# Altium schematic sheet Schematic.SchDoc
size 558 x 431 mm; SheetNumber: 1; SheetTotal: 1
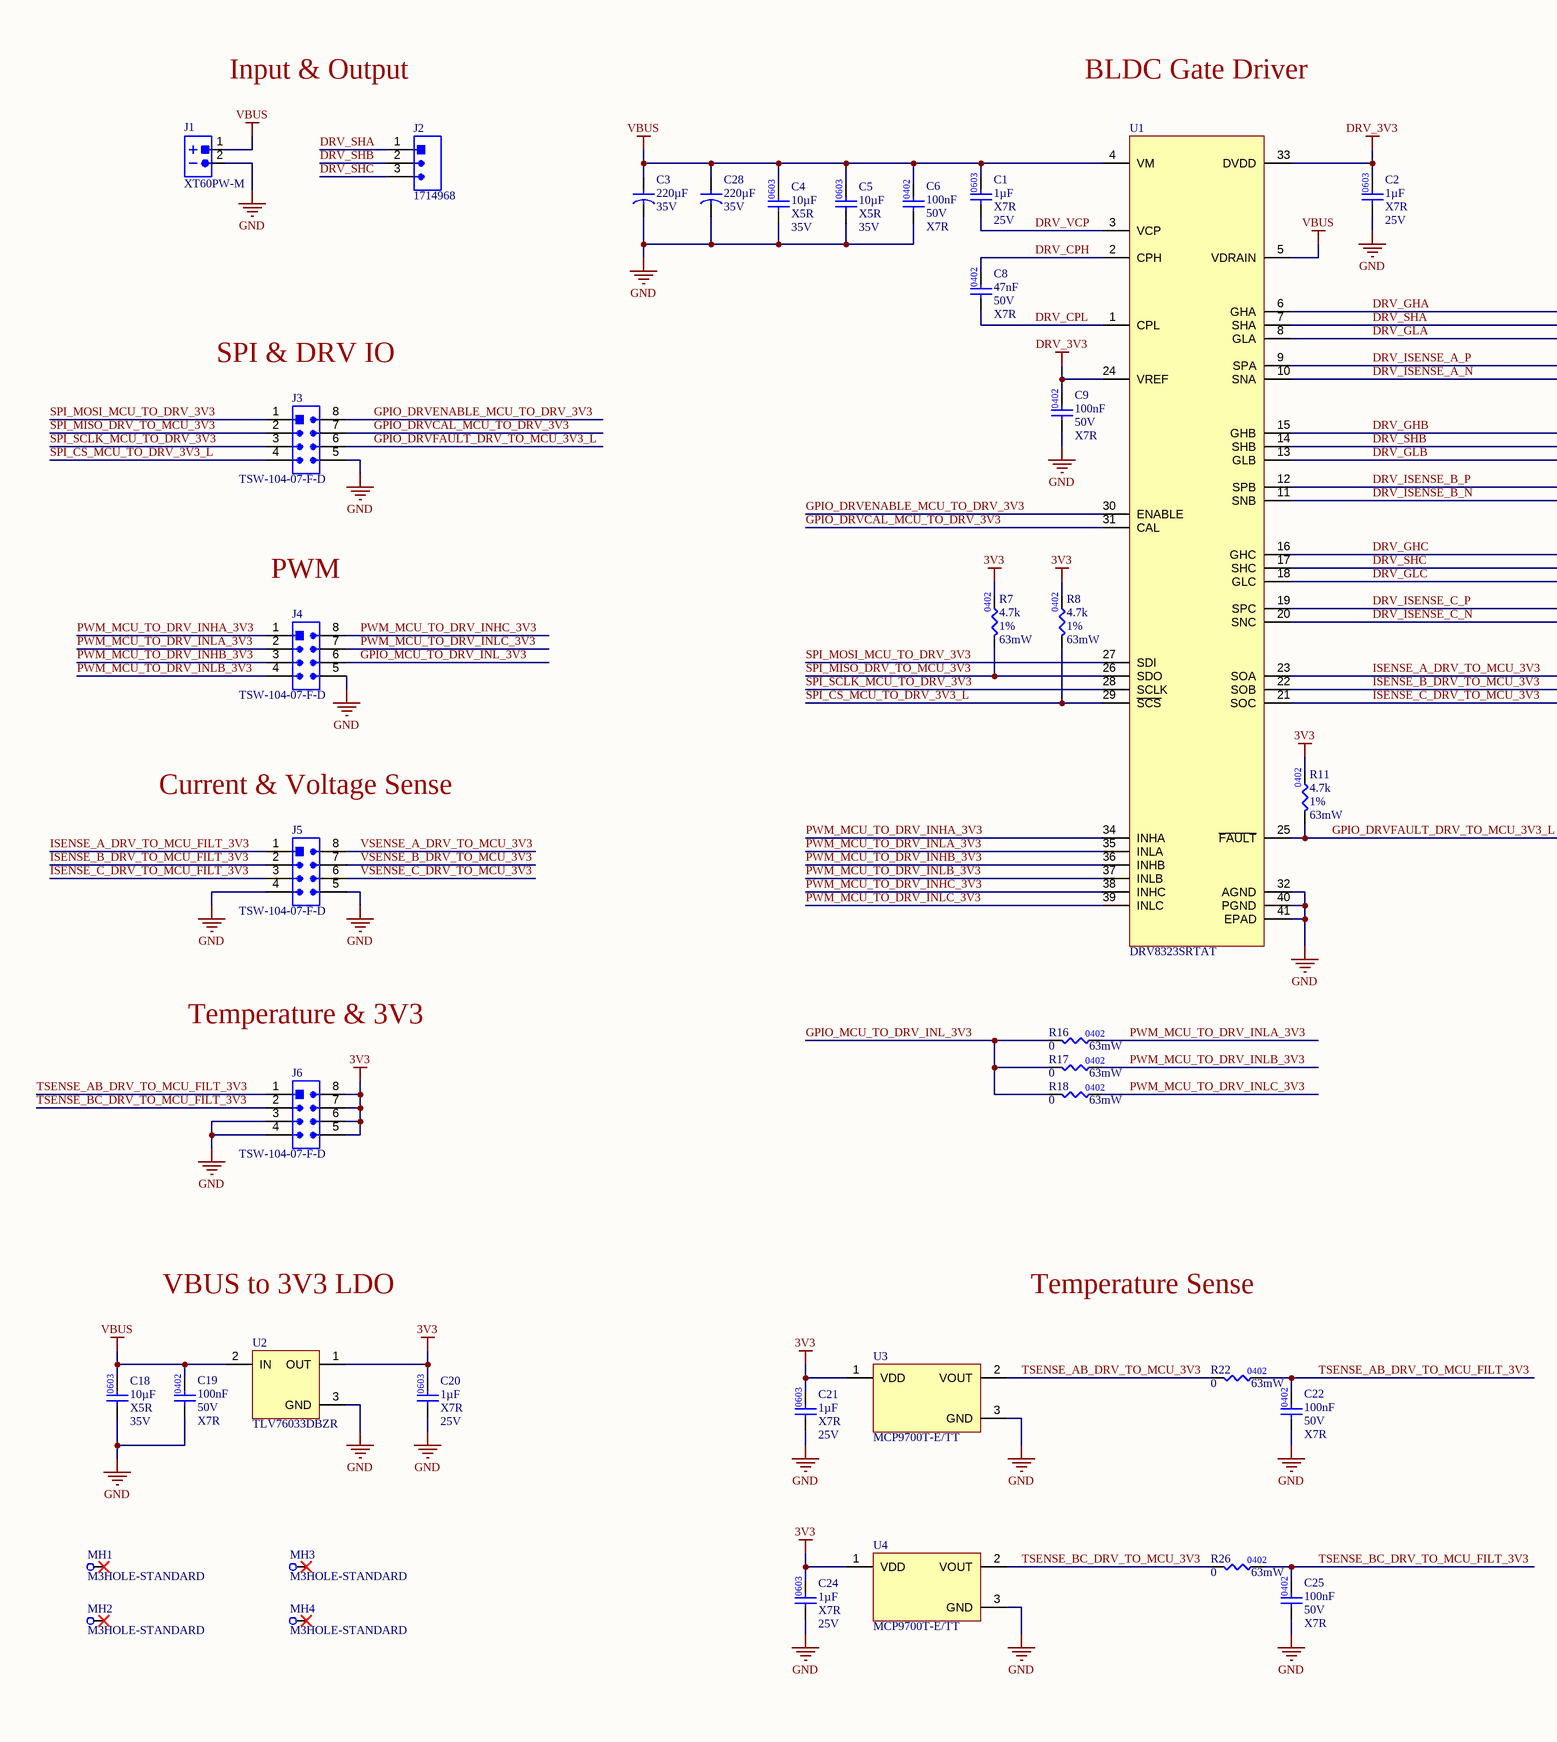
[diagram p0: Schematic.SchDoc, left]
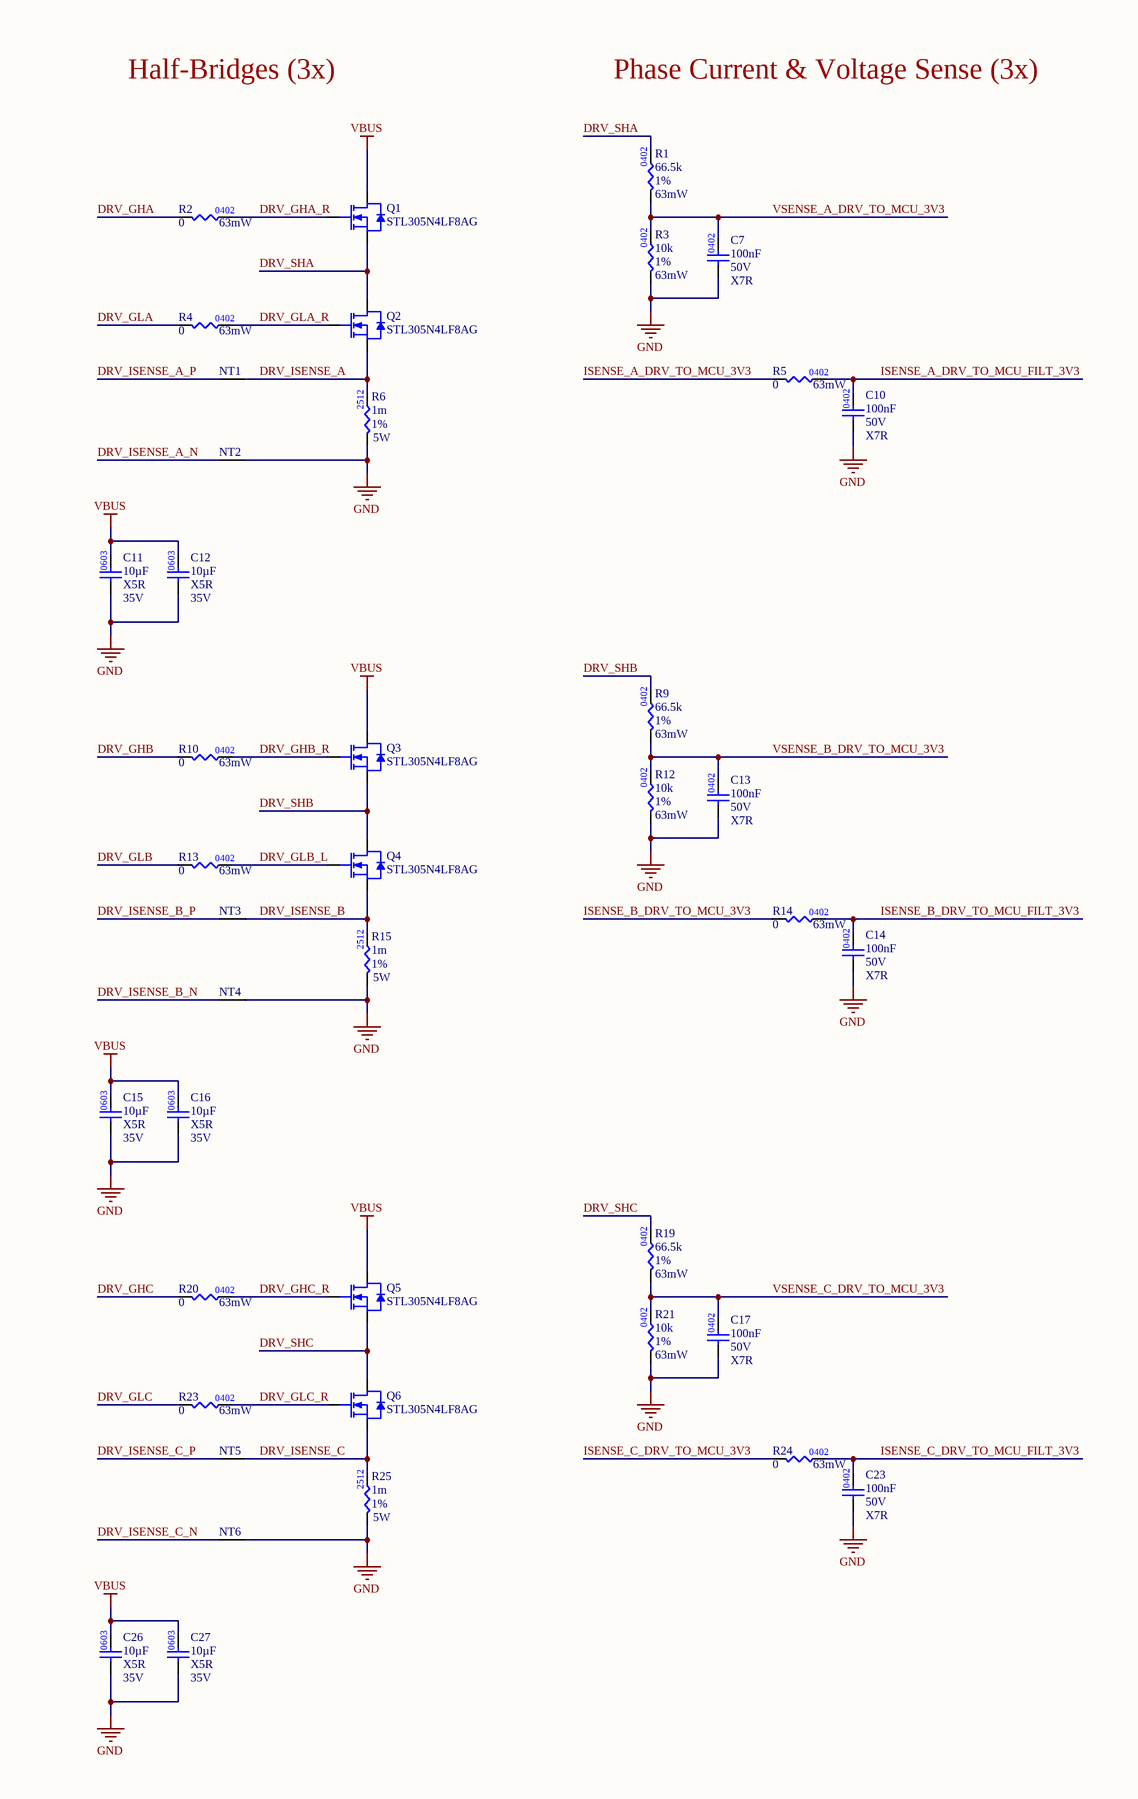
[diagram p1: Schematic.SchDoc, right]

## Parts
C1  value 1µF  Temperature Coefficient: X7R  Voltage Rating: 25V  [.CAP_0603-Footprint-1]  (hidden comment: CL10B105KA8NNNC)
C2  value 1µF  Temperature Coefficient: X7R  Voltage Rating: 25V  [.CAP_0603-Footprint-1]  (hidden comment: CL10B105KA8NNNC)
C3  value 220µF  Voltage Rating: 35V  [865080553014-Footprint-1]  (hidden comment: 865080553014)
C4  value 10µF  Temperature Coefficient: X5R  Voltage Rating: 35V  [.CAP_0603-Footprint-1]  (hidden comment: GRM188R6YA106MA73D)
C5  value 10µF  Temperature Coefficient: X5R  Voltage Rating: 35V  [.CAP_0603-Footprint-1]  (hidden comment: GRM188R6YA106MA73D)
C6  value 100nF  Voltage Rating: 50V  Temperature Coefficient: X7R  [.CAP_0402-Footprint-1]  (hidden comment: GCM155R71H104KE02D)
C7  value 100nF  Voltage Rating: 50V  Temperature Coefficient: X7R  [.CAP_0402-Footprint-1]  (hidden comment: GCM155R71H104KE02D)
C8  value 47nF  Voltage Rating: 50V  Temperature Coefficient: X7R  [.CAP_0402-Footprint-1]  (hidden comment: GRM155R71H473KE14D)
C9  value 100nF  Voltage Rating: 50V  Temperature Coefficient: X7R  [.CAP_0402-Footprint-1]  (hidden comment: GCM155R71H104KE02D)
C10  value 100nF  Voltage Rating: 50V  Temperature Coefficient: X7R  [.CAP_0402-Footprint-1]  (hidden comment: GCM155R71H104KE02D)
C11  value 10µF  Temperature Coefficient: X5R  Voltage Rating: 35V  [.CAP_0603-Footprint-1]  (hidden comment: GRM188R6YA106MA73D)
C12  value 10µF  Temperature Coefficient: X5R  Voltage Rating: 35V  [.CAP_0603-Footprint-1]  (hidden comment: GRM188R6YA106MA73D)
C13  value 100nF  Voltage Rating: 50V  Temperature Coefficient: X7R  [.CAP_0402-Footprint-1]  (hidden comment: GCM155R71H104KE02D)
C14  value 100nF  Voltage Rating: 50V  Temperature Coefficient: X7R  [.CAP_0402-Footprint-1]  (hidden comment: GCM155R71H104KE02D)
C15  value 10µF  Temperature Coefficient: X5R  Voltage Rating: 35V  [.CAP_0603-Footprint-1]  (hidden comment: GRM188R6YA106MA73D)
C16  value 10µF  Temperature Coefficient: X5R  Voltage Rating: 35V  [.CAP_0603-Footprint-1]  (hidden comment: GRM188R6YA106MA73D)
C17  value 100nF  Voltage Rating: 50V  Temperature Coefficient: X7R  [.CAP_0402-Footprint-1]  (hidden comment: GCM155R71H104KE02D)
C18  value 10µF  Temperature Coefficient: X5R  Voltage Rating: 35V  [.CAP_0603-Footprint-1]  (hidden comment: GRM188R6YA106MA73D)
C19  value 100nF  Voltage Rating: 50V  Temperature Coefficient: X7R  [.CAP_0402-Footprint-1]  (hidden comment: GCM155R71H104KE02D)
C20  value 1µF  Temperature Coefficient: X7R  Voltage Rating: 25V  [.CAP_0603-Footprint-1]  (hidden comment: CL10B105KA8NNNC)
C21  value 1µF  Temperature Coefficient: X7R  Voltage Rating: 25V  [.CAP_0603-Footprint-1]  (hidden comment: CL10B105KA8NNNC)
C22  value 100nF  Voltage Rating: 50V  Temperature Coefficient: X7R  [.CAP_0402-Footprint-1]  (hidden comment: GCM155R71H104KE02D)
C23  value 100nF  Voltage Rating: 50V  Temperature Coefficient: X7R  [.CAP_0402-Footprint-1]  (hidden comment: GCM155R71H104KE02D)
C24  value 1µF  Temperature Coefficient: X7R  Voltage Rating: 25V  [.CAP_0603-Footprint-1]  (hidden comment: CL10B105KA8NNNC)
C25  value 100nF  Voltage Rating: 50V  Temperature Coefficient: X7R  [.CAP_0402-Footprint-1]  (hidden comment: GCM155R71H104KE02D)
C26  value 10µF  Temperature Coefficient: X5R  Voltage Rating: 35V  [.CAP_0603-Footprint-1]  (hidden comment: GRM188R6YA106MA73D)
C27  value 10µF  Temperature Coefficient: X5R  Voltage Rating: 35V  [.CAP_0603-Footprint-1]  (hidden comment: GRM188R6YA106MA73D)
C28  value 220µF  Voltage Rating: 35V  [865080553014-Footprint-1]  (hidden comment: 865080553014)
J1  XT60PW-M  [XT60PW-M-Footprint-1]
J2  1714968  [1714968-Footprint-1]
J3  TSW-104-07-F-D  [TSW-104-07-F-D-Footprint-1]
J4  TSW-104-07-F-D  [TSW-104-07-F-D-Footprint-1]
J5  TSW-104-07-F-D  [TSW-104-07-F-D-Footprint-1]
J6  TSW-104-07-F-D  [TSW-104-07-F-D-Footprint-1]
MH1  M3HOLE-STANDARD  [M3HOLE-STANDARD-Footprint-1]
MH2  M3HOLE-STANDARD  [M3HOLE-STANDARD-Footprint-1]
MH3  M3HOLE-STANDARD  [M3HOLE-STANDARD-Footprint-1]
MH4  M3HOLE-STANDARD  [M3HOLE-STANDARD-Footprint-1]
NT1  NET_TIE_127um  [NET_TIE_127um-Footprint-1]  (value not drawn)
NT2  NET_TIE_127um  [NET_TIE_127um-Footprint-1]  (value not drawn)
NT3  NET_TIE_127um  [NET_TIE_127um-Footprint-1]  (value not drawn)
NT4  NET_TIE_127um  [NET_TIE_127um-Footprint-1]  (value not drawn)
NT5  NET_TIE_127um  [NET_TIE_127um-Footprint-1]  (value not drawn)
NT6  NET_TIE_127um  [NET_TIE_127um-Footprint-1]  (value not drawn)
Q1  STL305N4LF8AG  [STL305N4LF8AG-Footprint-1]
Q2  STL305N4LF8AG  [STL305N4LF8AG-Footprint-1]
Q3  STL305N4LF8AG  [STL305N4LF8AG-Footprint-1]
Q4  STL305N4LF8AG  [STL305N4LF8AG-Footprint-1]
Q5  STL305N4LF8AG  [STL305N4LF8AG-Footprint-1]
Q6  STL305N4LF8AG  [STL305N4LF8AG-Footprint-1]
R1  value 66.5k  Tolerance: 1%  Power: 63mW  [.RES_0402-Footprint-1]  (hidden comment: RC0402FR-0766K5L)
R2  value 0  Power: 63mW  [.RES_0402-Footprint-1]  (hidden comment: RC0402JR-070RL)
R3  value 10k  Tolerance: 1%  Power: 63mW  [.RES_0402-Footprint-1]  (hidden comment: RC0402FR-0710KL)
R4  value 0  Power: 63mW  [.RES_0402-Footprint-1]  (hidden comment: RC0402JR-070RL)
R5  value 0  Power: 63mW  [.RES_0402-Footprint-1]  (hidden comment: RC0402JR-070RL)
R6  value 1m  Power: 5W  Tolerance: 1%  [WSLF25121L000FEA-Footprint-1]  (hidden comment: WSLF25121L000FEA)
R7  value 4.7k  Tolerance: 1%  Power: 63mW  [.RES_0402-Footprint-1]  (hidden comment: RC0402FR-074K7L)
R8  value 4.7k  Tolerance: 1%  Power: 63mW  [.RES_0402-Footprint-1]  (hidden comment: RC0402FR-074K7L)
R9  value 66.5k  Tolerance: 1%  Power: 63mW  [.RES_0402-Footprint-1]  (hidden comment: RC0402FR-0766K5L)
R10  value 0  Power: 63mW  [.RES_0402-Footprint-1]  (hidden comment: RC0402JR-070RL)
R11  value 4.7k  Tolerance: 1%  Power: 63mW  [.RES_0402-Footprint-1]  (hidden comment: RC0402FR-074K7L)
R12  value 10k  Tolerance: 1%  Power: 63mW  [.RES_0402-Footprint-1]  (hidden comment: RC0402FR-0710KL)
R13  value 0  Power: 63mW  [.RES_0402-Footprint-1]  (hidden comment: RC0402JR-070RL)
R14  value 0  Power: 63mW  [.RES_0402-Footprint-1]  (hidden comment: RC0402JR-070RL)
R15  value 1m  Power: 5W  Tolerance: 1%  [WSLF25121L000FEA-Footprint-1]  (hidden comment: WSLF25121L000FEA)
R16  value 0  Power: 63mW  [.RES_0402-Footprint-1]  (hidden comment: RC0402JR-070RL)
R17  value 0  Power: 63mW  [.RES_0402-Footprint-1]  (hidden comment: RC0402JR-070RL)
R18  value 0  Power: 63mW  [.RES_0402-Footprint-1]  (hidden comment: RC0402JR-070RL)
R19  value 66.5k  Tolerance: 1%  Power: 63mW  [.RES_0402-Footprint-1]  (hidden comment: RC0402FR-0766K5L)
R20  value 0  Power: 63mW  [.RES_0402-Footprint-1]  (hidden comment: RC0402JR-070RL)
R21  value 10k  Tolerance: 1%  Power: 63mW  [.RES_0402-Footprint-1]  (hidden comment: RC0402FR-0710KL)
R22  value 0  Power: 63mW  [.RES_0402-Footprint-1]  (hidden comment: RC0402JR-070RL)
R23  value 0  Power: 63mW  [.RES_0402-Footprint-1]  (hidden comment: RC0402JR-070RL)
R24  value 0  Power: 63mW  [.RES_0402-Footprint-1]  (hidden comment: RC0402JR-070RL)
R25  value 1m  Power: 5W  Tolerance: 1%  [WSLF25121L000FEA-Footprint-1]  (hidden comment: WSLF25121L000FEA)
R26  value 0  Power: 63mW  [.RES_0402-Footprint-1]  (hidden comment: RC0402JR-070RL)
U1  DRV8323SRTAT  [QFN50P600X600X80_HS-41N]
U2  TLV76033DBZR  [TLV76033DBZR-Footprint-1]
U3  MCP9700T-E/TT  [MCP9700T-E_TT-Footprint-1]
U4  MCP9700T-E/TT  [MCP9700T-E_TT-Footprint-1]

## Nets
3V3: C20.2 C21.2 C24.2 J6.5 J6.6 J6.7 J6.8 R7.2 R8.2 R11.2 U2.1(OUT) U3.1(VDD) U4.1(VDD)
DRV_3V3: C2.2 C9.2 U1.24(VREF) U1.33(DVDD)
GND: C2.1 C3.2 C4.1 C5.1 C6.1 C7.1 C9.1 C10.1 C11.1 C12.1 C13.1 C14.1 C15.1 C16.1 C17.1 C18.1 C19.1 C20.1 C21.1 C22.1 C23.1 C24.1 C25.1 C26.1 C27.1 C28.2 J1.2 J3.5 J4.5 J5.4 J5.5 J6.3 J6.4 NT2.2 NT4.2 NT6.2 R3.1 R6.1 R12.1 R15.1 R21.1 R25.1 U1.32(AGND) U1.40(PGND) U1.41(EPAD) U2.3(GND) U3.3(GND) U4.3(GND)
VBUS: C1.2 C3.1 C4.2 C5.2 C6.2 C11.2 C12.2 C15.2 C16.2 C18.2 C19.2 C26.2 C27.2 C28.1 J1.1 Q1.3(D) Q3.3(D) Q5.3(D) U1.4(VM) U1.5(VDRAIN) U2.2(IN)
DRV_CPH: C8.2 U1.2(CPH)
DRV_CPL: C8.1 U1.1(CPL)
DRV_GHA: R2.1 U1.6(GHA)
DRV_GHA_R: Q1.1(G) R2.2
DRV_GHB: R10.1 U1.15(GHB)
DRV_GHB_R: Q3.1(G) R10.2
DRV_GHC: R20.1 U1.16(GHC)
DRV_GHC_R: Q5.1(G) R20.2
DRV_GLA: R4.1 U1.8(GLA)
DRV_GLA_R: Q2.1(G) R4.2
DRV_GLB: R13.1 U1.13(GLB)
DRV_GLB_L: Q4.1(G) R13.2
DRV_GLC: R23.1 U1.18(GLC)
DRV_GLC_R: Q6.1(G) R23.2
DRV_ISENSE_A: NT1.2 Q2.2(S) R6.2
DRV_ISENSE_A_N: NT2.1 U1.10(SNA)
DRV_ISENSE_A_P: NT1.1 U1.9(SPA)
DRV_ISENSE_B: NT3.2 Q4.2(S) R15.2
DRV_ISENSE_B_N: NT4.1 U1.11(SNB)
DRV_ISENSE_B_P: NT3.1 U1.12(SPB)
DRV_ISENSE_C: NT5.2 Q6.2(S) R25.2
DRV_ISENSE_C_N: NT6.1 U1.20(SNC)
DRV_ISENSE_C_P: NT5.1 U1.19(SPC)
DRV_SHA: J2.1 Q1.2(S) Q2.3(D) R1.2 U1.7(SHA)
DRV_SHB: J2.2 Q3.2(S) Q4.3(D) R9.2 U1.14(SHB)
DRV_SHC: J2.3 Q5.2(S) Q6.3(D) R19.2 U1.17(SHC)
DRV_VCP: C1.1 U1.3(VCP)
GPIO_DRVCAL_MCU_TO_DRV_3V3: J3.7 U1.31(CAL)
GPIO_DRVENABLE_MCU_TO_DRV_3V3: J3.8 U1.30(ENABLE)
GPIO_DRVFAULT_DRV_TO_MCU_3V3_L: J3.6 R11.1 U1.25(~{FAULT})
GPIO_MCU_TO_DRV_INL_3V3: J4.6 R16.1 R17.1 R18.1
ISENSE_A_DRV_TO_MCU_3V3: R5.1 U1.23(SOA)
ISENSE_A_DRV_TO_MCU_FILT_3V3: C10.2 J5.1 R5.2
ISENSE_B_DRV_TO_MCU_3V3: R14.1 U1.22(SOB)
ISENSE_B_DRV_TO_MCU_FILT_3V3: C14.2 J5.2 R14.2
ISENSE_C_DRV_TO_MCU_3V3: R24.1 U1.21(SOC)
ISENSE_C_DRV_TO_MCU_FILT_3V3: C23.2 J5.3 R24.2
PWM_MCU_TO_DRV_INHA_3V3: J4.1 U1.34(INHA)
PWM_MCU_TO_DRV_INHB_3V3: J4.3 U1.36(INHB)
PWM_MCU_TO_DRV_INHC_3V3: J4.8 U1.38(INHC)
PWM_MCU_TO_DRV_INLA_3V3: J4.2 R16.2 U1.35(INLA)
PWM_MCU_TO_DRV_INLB_3V3: J4.4 R17.2 U1.37(INLB)
PWM_MCU_TO_DRV_INLC_3V3: J4.7 R18.2 U1.39(INLC)
SPI_CS_MCU_TO_DRV_3V3_L: J3.4 R8.1 U1.29(~{SCS})
SPI_MISO_DRV_TO_MCU_3V3: J3.2 R7.1 U1.26(SDO)
SPI_MOSI_MCU_TO_DRV_3V3: J3.1 U1.27(SDI)
SPI_SCLK_MCU_TO_DRV_3V3: J3.3 U1.28(SCLK)
TSENSE_AB_DRV_TO_MCU_3V3: R22.1 U3.2(VOUT)
TSENSE_AB_DRV_TO_MCU_FILT_3V3: C22.2 J6.1 R22.2
TSENSE_BC_DRV_TO_MCU_3V3: R26.1 U4.2(VOUT)
TSENSE_BC_DRV_TO_MCU_FILT_3V3: C25.2 J6.2 R26.2
VSENSE_A_DRV_TO_MCU_3V3: C7.2 J5.8 R1.1 R3.2
VSENSE_B_DRV_TO_MCU_3V3: C13.2 J5.7 R9.1 R12.2
VSENSE_C_DRV_TO_MCU_3V3: C17.2 J5.6 R19.1 R21.2

Not connected (* = marked no-connect by the designer): MH1 1*; MH2 1*; MH3 1*; MH4 1*

## Notes on the sheet
- Input & Output
- BLDC Gate Driver
- Half-Bridges (3x)
- Phase Current & Voltage Sense (3x)
- (near J3) SPI & DRV IO
- (near J4) PWM
- (near J5) Current & Voltage Sense
- Temperature & 3V3
- VBUS to 3V3 LDO
- Temperature Sense
- DWG. NO.
- REV.
- SHT.
- REVISION
- DESCRIPTION
- DATE
- APPROVED
- THIS DOCUMENT AND THE DATA DISCLOSED HEREIN OR HEREWITH IS THE PROPERTY OF ALTIUM LIMITED AND MAY BE FREELY DISTRIBUTED IN WHOLE. NO RIGHTS ARE RESERVED OR EXPRESS OR IMPLIED WARANTEE GIVEN.
- ENG:
- DSN:
- APPROVALS
- PROJECT
- DOCUMENT REVISION:
- DESIGN ITEM:
- CHK:
- BOM:
- REFERENCE DOCUMENTS
- PROJECT REVISION:
- TITLE
- FAB DWG:
- PCB DWG:
- ASSY DWG:
- SCALE:
- SIZE
- C
- CAGE CODE
- FILE NAME
- DWG NO.
- SHEET
- OF
- REV

## Library data of the parts
C1 C2 C20 C21 C24 = CMP-001-00087-3: CAP CER 1UF 25V X7R 0603; Capacitor Type: MLCC; Tolerance: 10%; Case/Package: 0603; Pins: 2; Mounting Technology: Surface Mount
C3 C28 = CMP-001-00089-1: CAP ALUM 220UF 20% 35V SMD; Capacitor Type: Aluminum Electrolytic; Tolerance: 20%; Mounting Technology: Surface Mount; Case/Package: Radial, Can - SMD; Pins: 2
C4 C5 C11 C12 C15 C16 C18 C26 C27 = CMP-001-00088-2: CAP CER 10UF 35V X5R 0603; Capacitor Type: MLCC; Tolerance: 20%; Mounting Technology: Surface Mount; Pins: 2; Case/Package: 0603
C6 C7 C9 C10 C13 C14 C17 C19 C22 C23 C25 = CMP-001-00084-4: CAP CER 0.1UF 50V X7R 0402; Tolerance: 10%; Capacitor Type: MLCC; Mounting Technology: Surface Mount; Case/Package: 0402; Pins: 2
C8 = CMP-001-00085-3: CAP CER 0.047UF 50V X7R 0402; Tolerance: 10%; Capacitor Type: MLCC; Pins: 2; Mounting Technology: Surface Mount; Case/Package: 0402
J1 = CMP-002-00071-2: XT60PW-M Connector; Connector Type: Through Hole; Gender: Male; Pins: 2
J2 = CMP-002-00073-1: TERM BLK 3P SIDE ENT 6.35MM PCB; Max Current Rating: 30A; Mounting Technology: Through Hole; Pins: 3
J3-J6 = CMP-002-00072-1: CONN HEADER VERT 8POS 2.54MM; Gender: Male; Connector Type: Header; Mounting Technology: Through Hole; Pins: 8
MH1-MH4 = CMP-00030-00001-1: M3 Mounting Hole
NT1-NT6 = CMP-00030-00002-12: 127um NET TIE
Q1-Q6 = CMP-013-00034-5: MOSFET N-CH 40V 120A POWERFLAT 5X6 WF; Vgs (Max): 16V; Vgs(th) (Max) @ Id: 2V @ 250µA; Rds On: 1mΩ; Input Capacitance: 5400pF; Gate Charge: 70nC; Transistor Type: N-Channel; Drain Current: 120A; Drain to Source Voltage: 40V; Mounting Technology: Surface Mount
R1 R9 R19 = CMP-009-00182-1: RES 66.5K OHM 1% 1/16W 0402; Pins: 2; Case/Package: 0402; Mounting Technology: Surface Mount
R2 R4 R5 R10 R13 R14 R16-R18 R20 R22-R24 R26 = CMP-009-00180-2: RES 0 OHM JUMPER 1/16W 0402; Case/Package: 0402; Mounting Technology: Surface Mount
R3 R12 R21 = CMP-009-00179-2: RES 10K OHM 1% 1/16W 0402; Pins: 2; Case/Package: 0402
R6 R15 R25 = CMP-009-00181-2: RES 0.001 OHM 1% 5W 2512; Pins: 2; Case/Package: 2512
R7 R8 R11 = CMP-009-00178-5: RES 4.7K OHM 1% 1/16W 0402; Case/Package: 0402; Mounting Technology: Surface Mount; Pins: 2
U1 = CMP-00024-00006-10: IC MTR DRV MULTPHAS 6-60V 40WQFN; Voltage Rating: 60V; Max Operating Temperature: 125°C; Min Operating Temperature: -40°C; Mounting Technology: Surface Mount; Case/Package: 40-WFQFN Exposed Pad
U2 = CMP-019-00049-1: IC REG LINEAR 3.3V 100MA SOT23-3; Dropout Voltage: 1.1V; Output Current: 100mA; Mounting Technology: Surface Mount; Case/Package: SOT-23-3; Output Voltage: 3.3V
U3 U4 = CMP-010-00025-3: SENSOR ANALOG -40C-125C SOT23-3; Sensor Type: Temperature; Case/Package: SOT-23-3; Pins: 3; Mounting Technology: Surface Mount